# Altium schematic sheet Keyboard.SchDoc
size A2
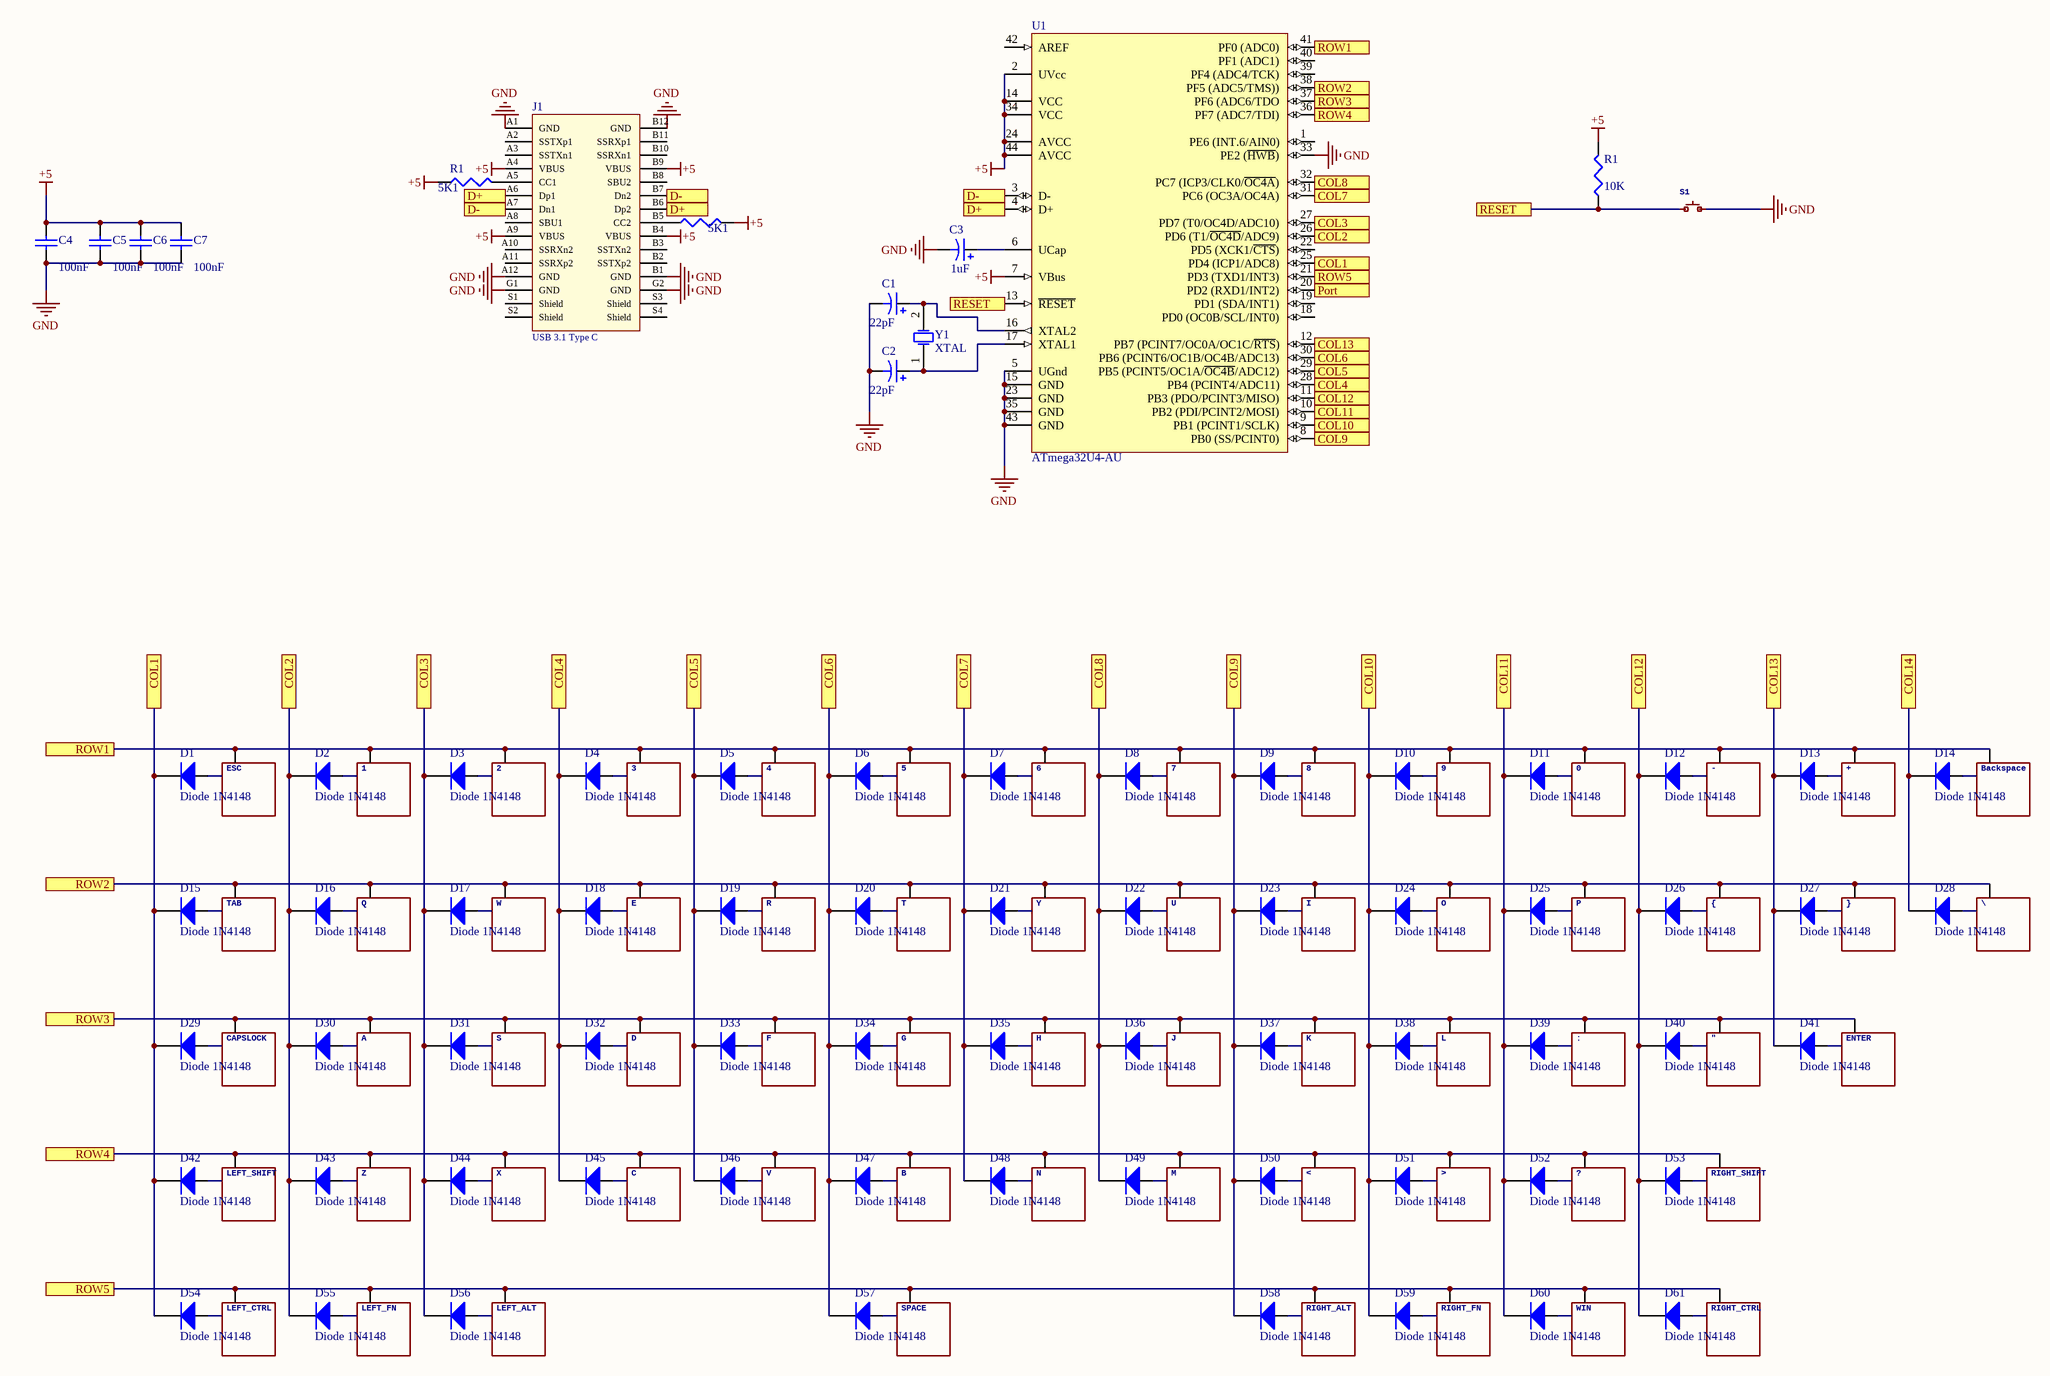
[diagram p0: Keyboard.SchDoc]

## Parts
(Parts that share a designator on the sheet are numbered #1, #2 ... from top to bottom, then left to right.)
0  KEYSWITCH-PLAIN-MX-1U  [MX-1U]  (value not drawn)
1  KEYSWITCH-PLAIN-MX-1U  [MX-1U]  (value not drawn)
2  KEYSWITCH-PLAIN-MX-1U  [MX-1U]  (value not drawn)
3  KEYSWITCH-PLAIN-MX-1U  [MX-1U]  (value not drawn)
4  KEYSWITCH-PLAIN-MX-1U  [MX-1U]  (value not drawn)
5  KEYSWITCH-PLAIN-MX-1U  [MX-1U]  (value not drawn)
6  KEYSWITCH-PLAIN-MX-1U  [MX-1U]  (value not drawn)
7  KEYSWITCH-PLAIN-MX-1U  [MX-1U]  (value not drawn)
8  KEYSWITCH-PLAIN-MX-1U  [MX-1U]  (value not drawn)
9  KEYSWITCH-PLAIN-MX-1U  [MX-1U]  (value not drawn)
"  KEYSWITCH-PLAIN-MX-1U  [MX-1U]  (value not drawn)
+  KEYSWITCH-PLAIN-MX-1U  [MX-1U]  (value not drawn)
-  KEYSWITCH-PLAIN-MX-1U  [MX-1U]  (value not drawn)
:  KEYSWITCH-PLAIN-MX-1U  [MX-1U]  (value not drawn)
<  KEYSWITCH-PLAIN-MX-1U  [MX-1U]  (value not drawn)
>  KEYSWITCH-PLAIN-MX-1U  [MX-1U]  (value not drawn)
?  KEYSWITCH-PLAIN-MX-1U  [MX-1U]  (value not drawn)
\  KEYSWITCH-PLAIN-MX-1U  [MX-1U]  (value not drawn)
A  KEYSWITCH-PLAIN-MX-1U  [MX-1U]  (value not drawn)
B  KEYSWITCH-PLAIN-MX-1U  [MX-1U]  (value not drawn)
Backspace  KEYSWITCH-PLAIN-MX-1U  [MX-1U]  (value not drawn)
C  KEYSWITCH-PLAIN-MX-1U  [MX-1U]  (value not drawn)
C1  value 22pF  [C0805]  (hidden comment: Cap Pol3)
C2  value 22pF  [C0805]  (hidden comment: Cap Pol3)
C3  value 1uF  [C0805]  (hidden comment: Cap Pol3)
C4  value 100nF  [1608[0603]]  (hidden comment: Cap)
C5  value 100nF  [1608[0603]]  (hidden comment: Cap)
C6  value 100nF  [1608[0603]]  (hidden comment: Cap)
C7  value 100nF  [1608[0603]]  (hidden comment: Cap)
CAPSLOCK  KEYSWITCH-PLAIN-MX-1U  [MX-1U]  (value not drawn)
D  KEYSWITCH-PLAIN-MX-1U  [MX-1U]  (value not drawn)
D1  Diode 1N4148  [DO-35]
D2  Diode 1N4148  [DO-35]
D3  Diode 1N4148  [DO-35]
D4  Diode 1N4148  [DO-35]
D5  Diode 1N4148  [DO-35]
D6  Diode 1N4148  [DO-35]
D7  Diode 1N4148  [DO-35]
D8  Diode 1N4148  [DO-35]
D9  Diode 1N4148  [DO-35]
D10  Diode 1N4148  [DO-35]
D11  Diode 1N4148  [DO-35]
D12  Diode 1N4148  [DO-35]
D13  Diode 1N4148  [DO-35]
D14  Diode 1N4148  [DO-35]
D15  Diode 1N4148  [DO-35]
D16  Diode 1N4148  [DO-35]
D17  Diode 1N4148  [DO-35]
D18  Diode 1N4148  [DO-35]
D19  Diode 1N4148  [DO-35]
D20  Diode 1N4148  [DO-35]
D21  Diode 1N4148  [DO-35]
D22  Diode 1N4148  [DO-35]
D23  Diode 1N4148  [DO-35]
D24  Diode 1N4148  [DO-35]
D25  Diode 1N4148  [DO-35]
D26  Diode 1N4148  [DO-35]
D27  Diode 1N4148  [DO-35]
D28  Diode 1N4148  [DO-35]
D29  Diode 1N4148  [DO-35]
D30  Diode 1N4148  [DO-35]
D31  Diode 1N4148  [DO-35]
D32  Diode 1N4148  [DO-35]
D33  Diode 1N4148  [DO-35]
D34  Diode 1N4148  [DO-35]
D35  Diode 1N4148  [DO-35]
D36  Diode 1N4148  [DO-35]
D37  Diode 1N4148  [DO-35]
D38  Diode 1N4148  [DO-35]
D39  Diode 1N4148  [DO-35]
D40  Diode 1N4148  [DO-35]
D41  Diode 1N4148  [DO-35]
D42  Diode 1N4148  [DO-35]
D43  Diode 1N4148  [DO-35]
D44  Diode 1N4148  [DO-35]
D45  Diode 1N4148  [DO-35]
D46  Diode 1N4148  [DO-35]
D47  Diode 1N4148  [DO-35]
D48  Diode 1N4148  [DO-35]
D49  Diode 1N4148  [DO-35]
D50  Diode 1N4148  [DO-35]
D51  Diode 1N4148  [DO-35]
D52  Diode 1N4148  [DO-35]
D53  Diode 1N4148  [DO-35]
D54  Diode 1N4148  [DO-35]
D55  Diode 1N4148  [DO-35]
D56  Diode 1N4148  [DO-35]
D57  Diode 1N4148  [DO-35]
D58  Diode 1N4148  [DO-35]
D59  Diode 1N4148  [DO-35]
D60  Diode 1N4148  [DO-35]
D61  Diode 1N4148  [DO-35]
E  KEYSWITCH-PLAIN-MX-1U  [MX-1U]  (value not drawn)
ENTER  KEYSWITCH-PLAIN-MX-1U  [MX-1U]  (value not drawn)
ESC  KEYSWITCH-PLAIN-MX-1U  [MX-1U]  (value not drawn)
F  KEYSWITCH-PLAIN-MX-1U  [MX-1U]  (value not drawn)
G  KEYSWITCH-PLAIN-MX-1U  [MX-1U]  (value not drawn)
H  KEYSWITCH-PLAIN-MX-1U  [MX-1U]  (value not drawn)
I  KEYSWITCH-PLAIN-MX-1U  [MX-1U]  (value not drawn)
J  KEYSWITCH-PLAIN-MX-1U  [MX-1U]  (value not drawn)
J1  USB 3.1 Type C  [632723100011]
K  KEYSWITCH-PLAIN-MX-1U  [MX-1U]  (value not drawn)
L  KEYSWITCH-PLAIN-MX-1U  [MX-1U]  (value not drawn)
LEFT_ALT  KEYSWITCH-PLAIN-MX-1U  [MX-1U]  (value not drawn)
LEFT_CTRL  KEYSWITCH-PLAIN-MX-1U  [MX-1U]  (value not drawn)
LEFT_FN  KEYSWITCH-PLAIN-MX-1U  [MX-1U]  (value not drawn)
LEFT_SHIFT  KEYSWITCH-PLAIN-MX-1U  [MX-1U]  (value not drawn)
M  KEYSWITCH-PLAIN-MX-1U  [MX-1U]  (value not drawn)
N  KEYSWITCH-PLAIN-MX-1U  [MX-1U]  (value not drawn)
O  KEYSWITCH-PLAIN-MX-1U  [MX-1U]  (value not drawn)
P  KEYSWITCH-PLAIN-MX-1U  [MX-1U]  (value not drawn)
Q  KEYSWITCH-PLAIN-MX-1U  [MX-1U]  (value not drawn)
R  KEYSWITCH-PLAIN-MX-1U  [MX-1U]  (value not drawn)
R1#1  value 5K1  [J1-0603]  (hidden comment: Res3)
R1#2  value 10K  [J1-0603]  (hidden comment: Res3)
R2  value 5K1  [J1-0603]  (hidden comment: Res3)
RIGHT_ALT  KEYSWITCH-PLAIN-MX-1U  [MX-1U]  (value not drawn)
RIGHT_CTRL  KEYSWITCH-PLAIN-MX-1U  [MX-1U]  (value not drawn)
RIGHT_FN  KEYSWITCH-PLAIN-MX-1U  [MX-1U]  (value not drawn)
RIGHT_SHIFT  KEYSWITCH-PLAIN-MX-1U  [MX-1U]  (value not drawn)
S  KEYSWITCH-PLAIN-MX-1U  [MX-1U]  (value not drawn)
S1  SPST.B3U-1000P(M)  [B3U-1000P(M)]  (value not drawn)
SPACE  KEYSWITCH-PLAIN-MX-1U  [MX-1U]  (value not drawn)
T  KEYSWITCH-PLAIN-MX-1U  [MX-1U]  (value not drawn)
TAB  KEYSWITCH-PLAIN-MX-1U  [MX-1U]  (value not drawn)
U  KEYSWITCH-PLAIN-MX-1U  [MX-1U]  (value not drawn)
U1  ATmega32U4-AU  [44ML_N]
V  KEYSWITCH-PLAIN-MX-1U  [MX-1U]  (value not drawn)
W  KEYSWITCH-PLAIN-MX-1U  [MX-1U]  (value not drawn)
WIN  KEYSWITCH-PLAIN-MX-1U  [MX-1U]  (value not drawn)
X  KEYSWITCH-PLAIN-MX-1U  [MX-1U]  (value not drawn)
Y  KEYSWITCH-PLAIN-MX-1U  [MX-1U]  (value not drawn)
Y1  XTAL  [R38]
Z  KEYSWITCH-PLAIN-MX-1U  [MX-1U]  (value not drawn)
{  KEYSWITCH-PLAIN-MX-1U  [MX-1U]  (value not drawn)
}  KEYSWITCH-PLAIN-MX-1U  [MX-1U]  (value not drawn)

## Ports
COL1, COL2, COL3, COL4, COL5, COL6, COL7, COL8, COL9, COL10, COL11, COL12, COL13, COL14, D+, D-, Port, RESET, ROW1, ROW2, ROW3, ROW4, ROW5

## Nets
+5: C4.2 C5.2 C6.2 C7.2 J1.A4(VBUS) J1.A9(VBUS) J1.B4(VBUS) J1.B9(VBUS) R1#1.1 R1#2.2 R2.2 U1.2(UVcc) U1.7(VBus) U1.14(VCC) U1.24(AVCC) U1.34(VCC) U1.44(AVCC)
GND: C1.2 C2.2 C3.2 C4.1 C5.1 C6.1 C7.1 J1.A1(GND) J1.A12(GND) J1.B1(GND) J1.B12(GND) J1.G1(GND) J1.G2(GND) S1.2 U1.5(UGnd) U1.15(GND) U1.23(GND) U1.33(PE2_(~{HWB})) U1.35(GND) U1.43(GND)
COL1: D1.2(K) D15.2(K) D29.2(K) D42.2(K) D54.2(K) U1.25(PD4_(ICP1/ADC8)) ; port COL1
COL2: D2.2(K) D16.2(K) D30.2(K) D43.2(K) D55.2(K) U1.26(PD6_(T1/~{OC4D}/ADC9)) ; port COL2
COL3: D3.2(K) D17.2(K) D31.2(K) D44.2(K) D56.2(K) U1.27(PD7_(T0/OC4D/ADC10)) ; port COL3
COL4: D4.2(K) D18.2(K) D32.2(K) D45.2(K) U1.28(PB4_(PCINT4/ADC11)) ; port COL4
COL5: D5.2(K) D19.2(K) D33.2(K) D46.2(K) U1.29(PB5_(PCINT5/OC1A/~{OC4B}/ADC12)) ; port COL5
COL6: D6.2(K) D20.2(K) D34.2(K) D47.2(K) D57.2(K) U1.30(PB6_(PCINT6/OC1B/OC4B/ADC13)) ; port COL6
COL7: D7.2(K) D21.2(K) D35.2(K) D48.2(K) U1.31(PC6_(OC3A/OC4A)) ; port COL7
COL8: D8.2(K) D22.2(K) D36.2(K) D49.2(K) U1.32(PC7_(ICP3/CLK0/~{OC4A})) ; port COL8
COL9: D9.2(K) D23.2(K) D37.2(K) D50.2(K) D58.2(K) U1.8(PB0_(SS/PCINT0)) ; port COL9
COL10: D10.2(K) D24.2(K) D38.2(K) D51.2(K) D59.2(K) U1.9(PB1_(PCINT1/SCLK)) ; port COL10
COL11: D11.2(K) D25.2(K) D39.2(K) D52.2(K) D60.2(K) U1.10(PB2_(PDI/PCINT2/MOSI)) ; port COL11
COL12: D12.2(K) D26.2(K) D40.2(K) D53.2(K) D61.2(K) U1.11(PB3_(PDO/PCINT3/MISO)) ; port COL12
COL13: D13.2(K) D27.2(K) D41.2(K) U1.12(PB7_(PCINT7/OC0A/OC1C/~{RTS})) ; port COL13
COL14: D14.2(K) D28.2(K) ; port COL14
D+: J1.A6(Dp1) J1.B6(Dp2) U1.4(D+) ; port D+
D-: J1.A7(Dn1) J1.B7(Dn2) U1.3(D-) ; port D-
Port: U1.20(PD2_(RXD1/INT2)) ; port Port
RESET: R1#2.1 S1.1 U1.13(~{RESET}) ; port RESET
ROW1: 0.MX2(P1) 1.MX2(P1) 2.MX2(P1) 3.MX2(P1) 4.MX2(P1) 5.MX2(P1) 6.MX2(P1) 7.MX2(P1) 8.MX2(P1) 9.MX2(P1) +.MX2(P1) -.MX2(P1) Backspace.MX2(P1) ESC.MX2(P1) U1.41(PF0_(ADC0)) ; port ROW1
ROW2: \.MX2(P1) E.MX2(P1) I.MX2(P1) O.MX2(P1) P.MX2(P1) Q.MX2(P1) R.MX2(P1) T.MX2(P1) TAB.MX2(P1) U.MX2(P1) U1.38(PF5_(ADC5/TMS))) W.MX2(P1) Y.MX2(P1) {.MX2(P1) }.MX2(P1) ; port ROW2
ROW3: ".MX2(P1) :.MX2(P1) A.MX2(P1) CAPSLOCK.MX2(P1) D.MX2(P1) ENTER.MX2(P1) F.MX2(P1) G.MX2(P1) H.MX2(P1) J.MX2(P1) K.MX2(P1) L.MX2(P1) S.MX2(P1) U1.37(PF6_(ADC6/TDO) ; port ROW3
ROW4: <.MX2(P1) >.MX2(P1) ?.MX2(P1) B.MX2(P1) C.MX2(P1) LEFT_SHIFT.MX2(P1) M.MX2(P1) N.MX2(P1) RIGHT_SHIFT.MX2(P1) U1.36(PF7_(ADC7/TDI)) V.MX2(P1) X.MX2(P1) Z.MX2(P1) ; port ROW4
ROW5: LEFT_ALT.MX2(P1) LEFT_CTRL.MX2(P1) LEFT_FN.MX2(P1) RIGHT_ALT.MX2(P1) RIGHT_CTRL.MX2(P1) RIGHT_FN.MX2(P1) SPACE.MX2(P1) U1.21(PD3_(TXD1/INT3)) WIN.MX2(P1) ; port ROW5
Net0_MX1: 0.MX1(P0) D11.1(A)
Net1_MX1: 1.MX1(P0) D2.1(A)
Net2_MX1: 2.MX1(P0) D3.1(A)
Net3_MX1: 3.MX1(P0) D4.1(A)
Net4_MX1: 4.MX1(P0) D5.1(A)
Net5_MX1: 5.MX1(P0) D6.1(A)
Net6_MX1: 6.MX1(P0) D7.1(A)
Net7_MX1: 7.MX1(P0) D8.1(A)
Net8_MX1: 8.MX1(P0) D9.1(A)
Net9_MX1: 9.MX1(P0) D10.1(A)
Net"_MX1: ".MX1(P0) D40.1(A)
Net+_MX1: +.MX1(P0) D13.1(A)
Net-_MX1: -.MX1(P0) D12.1(A)
Net:_MX1: :.MX1(P0) D39.1(A)
Net<_MX1: <.MX1(P0) D50.1(A)
Net>_MX1: >.MX1(P0) D51.1(A)
Net?_MX1: ?.MX1(P0) D52.1(A)
Ne~{t}_MX1: \.MX1(P0) D28.1(A)
NetA_MX1: A.MX1(P0) D30.1(A)
NetB_MX1: B.MX1(P0) D47.1(A)
NetBackspace_MX1: Backspace.MX1(P0) D14.1(A)
NetC1_1: C1.1 U1.16(XTAL2) Y1.2(OSC2)
NetC2_1: C2.1 U1.17(XTAL1) Y1.1(OSC1)
NetC3_1: C3.1 U1.6(UCap)
NetC_MX1: C.MX1(P0) D45.1(A)
NetCAPSLOCK_MX1: CAPSLOCK.MX1(P0) D29.1(A)
NetD1_1: D1.1(A) ESC.MX1(P0)
NetD15_1: D15.1(A) TAB.MX1(P0)
NetD16_1: D16.1(A) Q.MX1(P0)
NetD17_1: D17.1(A) W.MX1(P0)
NetD18_1: D18.1(A) E.MX1(P0)
NetD19_1: D19.1(A) R.MX1(P0)
NetD20_1: D20.1(A) T.MX1(P0)
NetD21_1: D21.1(A) Y.MX1(P0)
NetD22_1: D22.1(A) U.MX1(P0)
NetD23_1: D23.1(A) I.MX1(P0)
NetD24_1: D24.1(A) O.MX1(P0)
NetD25_1: D25.1(A) P.MX1(P0)
NetD26_1: D26.1(A) {.MX1(P0)
NetD27_1: D27.1(A) }.MX1(P0)
NetD31_1: D31.1(A) S.MX1(P0)
NetD33_1: D33.1(A) F.MX1(P0)
NetD34_1: D34.1(A) G.MX1(P0)
NetD35_1: D35.1(A) H.MX1(P0)
NetD36_1: D36.1(A) J.MX1(P0)
NetD37_1: D37.1(A) K.MX1(P0)
NetD38_1: D38.1(A) L.MX1(P0)
NetD41_1: D41.1(A) ENTER.MX1(P0)
NetD42_1: D42.1(A) LEFT_SHIFT.MX1(P0)
NetD43_1: D43.1(A) Z.MX1(P0)
NetD44_1: D44.1(A) X.MX1(P0)
NetD46_1: D46.1(A) V.MX1(P0)
NetD48_1: D48.1(A) N.MX1(P0)
NetD49_1: D49.1(A) M.MX1(P0)
NetD53_1: D53.1(A) RIGHT_SHIFT.MX1(P0)
NetD54_1: D54.1(A) LEFT_CTRL.MX1(P0)
NetD55_1: D55.1(A) LEFT_FN.MX1(P0)
NetD56_1: D56.1(A) LEFT_ALT.MX1(P0)
NetD57_1: D57.1(A) SPACE.MX1(P0)
NetD58_1: D58.1(A) RIGHT_ALT.MX1(P0)
NetD59_1: D59.1(A) RIGHT_FN.MX1(P0)
NetD60_1: D60.1(A) WIN.MX1(P0)
NetD61_1: D61.1(A) RIGHT_CTRL.MX1(P0)
NetD_MX1: D.MX1(P0) D32.1(A)
NetJ1_A5: J1.A5(CC1) R1#1.2
NetJ1_B5: J1.B5(CC2) R2.1

Not connected (* = marked no-connect by the designer): J1 A2(SSTXp1) A3(SSTXn1) A8(SBU1) A10(SSRXn2) A11(SSRXp2) B2(SSTXp2) B3(SSTXn2) B8(SBU2) B10(SSRXn1) B11(SSRXp1) S1(Shield) S2(Shield) S3(Shield) S4(Shield); U1 1(PE6_(INT.6/AIN0)) 18(PD0_(OC0B/SCL/INT0)) 19(PD1_(SDA/INT1)) 22(PD5_(XCK1/~{CTS})) 39(PF4_(ADC4/TCK)) 40(PF1_(ADC1)) 42(AREF)

## Library data of the parts
0-9 " + - : < > ? \ A B Backspace C CAPSLOCK D E ENTER ESC F G H I J K L LEFT_ALT LEFT_CTRL LEFT_FN LEFT_SHIFT M N O P Q R RIGHT_ALT RIGHT_CTRL RIGHT_FN RIGHT_SHIFT S SPACE T TAB U V W WIN X Y Z { } = KEYSWITCH-PLAIN-MX-1U: GateName_1: G$1; DeviceName: -MX-1U; SymbolName_1: KEYSWITCH-PLAIN; LibraryName: Keyboard; DeviceSetName: KEYSWITCH-PLAIN; Package: MX-1U
C1-C3 = Cap Pol3: Polarized Capacitor (Surface Mount); Published: 8-Jun-2000; LatestRevisionDate: 29-May-2009; LatestRevisionNote: IPC-7351 Footprint Added.; PackageReference: C0805; Publisher: Altium Limited; PackageDescription: Chip Capacitor
C4-C7 = Cap: Capacitor; Published: 8-Jun-2000; LatestRevisionDate: 17-Jul-2002; LatestRevisionNote: Re-released for DXP Platform.; PackageReference: RAD-0.3; Publisher: Altium Limited; PackageDescription: Radial Cap, Thru-Hole; 2 Leads; 0.3 in Pin Spacing
D1-D61 = Diode 1N4148: High Conductance Fast Diode; Published: 8-Jun-2000; LatestRevisionDate: 17-Jul-2002; LatestRevisionNote: Re-released for DXP Platform.; DatasheetVersion: 1997; PackageReference: DO-35; Publisher: Altium Limited; PackageDescription: Diode, Axial; Body 3.8 x 1.9 mm (LxDia. max), Lead Dia. 0.53 mm (max); Code_JEDEC: DO-204-AH; ComponentLink1Description: Manufacturer Link; ComponentLink1URL: http://www.fairchildsemi.com/; ComponentLink2Description: Datasheet; ComponentLink2URL: http://www.fairchildsemi.com/ds/1N%2F1N4148.pdf
J1 = 632723100011: USB 3.1 Type C Receptacle Horizontal THR WR-COM; Rated Current: 5 A; Gender: Female Plug; ComponentLink1Description: Manufacturer; ComponentLink1URL: http://www.we-online.de; ComponentLink2Description: Datasheet; ComponentLink2URL: http://katalog.we-online.de/em/datasheet/632723x00011.pdf; Part Number: 632723100011; Published Date: May 2018; Publisher: Wurth Elektronik; Orientation: Horizontal; Interface Type: USB 3.1 Type C; Operating Temperature: -25 to 105 degC; Mounting Technology: THR; Packaging: Tape and Reel with Cap
R1#1 R1#2 R2 = Res3: Resistor; Published: 8-Jun-2000; LatestRevisionDate: 29-May-2009; LatestRevisionNote: IPC-7351 Footprint Added.; PackageReference: J1-0603; Publisher: Altium Limited; PackageDescription: Chip Resistor
S1 = SPST.B3U-1000P(M): GateName_1: G$1; SymbolName_1: SPST; DeviceName: .B3U-1000P(M); LibraryName: omran_switches; DeviceSetName: SPST; Package: B3U-1000P(M)
U1 = ATmega32U4-AU: 8-bit AVR Microcontroller, 2.7-5.5V, 16MHz, 32KB Flash, 1KB EEPROM, 2.5KB SRAM, USB Controller, 44-pin TQFP, Industrial Grade (-40°C to 85°C), Ext Osc; DatasheetVersion: revF, Nov-2010; PackageVersion: rev.G, Jul-2007; PackageReference: 44ML; PackageDescription: 44-Pin Plastic Thin Quad Flat Pack, 10 x 10 x 1.0 mm Body, 0.8 mm Pitch (TQFP); ComponentLink1Description: Manufacturer URL; ComponentLink1URL: http://www.atmel.com/; ComponentLink2Description: ATmega16U4/32U4 Datasheet; ComponentLink2URL: http://www.atmel.com/dyn/resources/prod_documents/doc7766.pdf; ComponentLink3Description: ATmega16U4 ATmega32U4 Summary; ComponentLink3URL: http://www.atmel.com/dyn/resources/prod_documents/7766S.pdf
Y1 = XTAL: Crystal Oscillator; Published: 8-Jun-2000; LatestRevisionDate: 17-Jul-2002; LatestRevisionNote: Re-released for DXP Platform.; PackageReference: R38; Publisher: Altium Limited; PackageDescription: Crystal, Thru-Hole; 2 Leads; Body 3.1 x 8.2 mm (Dia.xH)